# Altium schematic sheet k26_baseboard_usb_c_conn.SchDoc: k26 Baseboard USB-C Connector
size A3; DrawnBy: Ch. Vogt; Organization: PBL; DocumentNumber: 1; Revision: r5; SheetNumber: 11
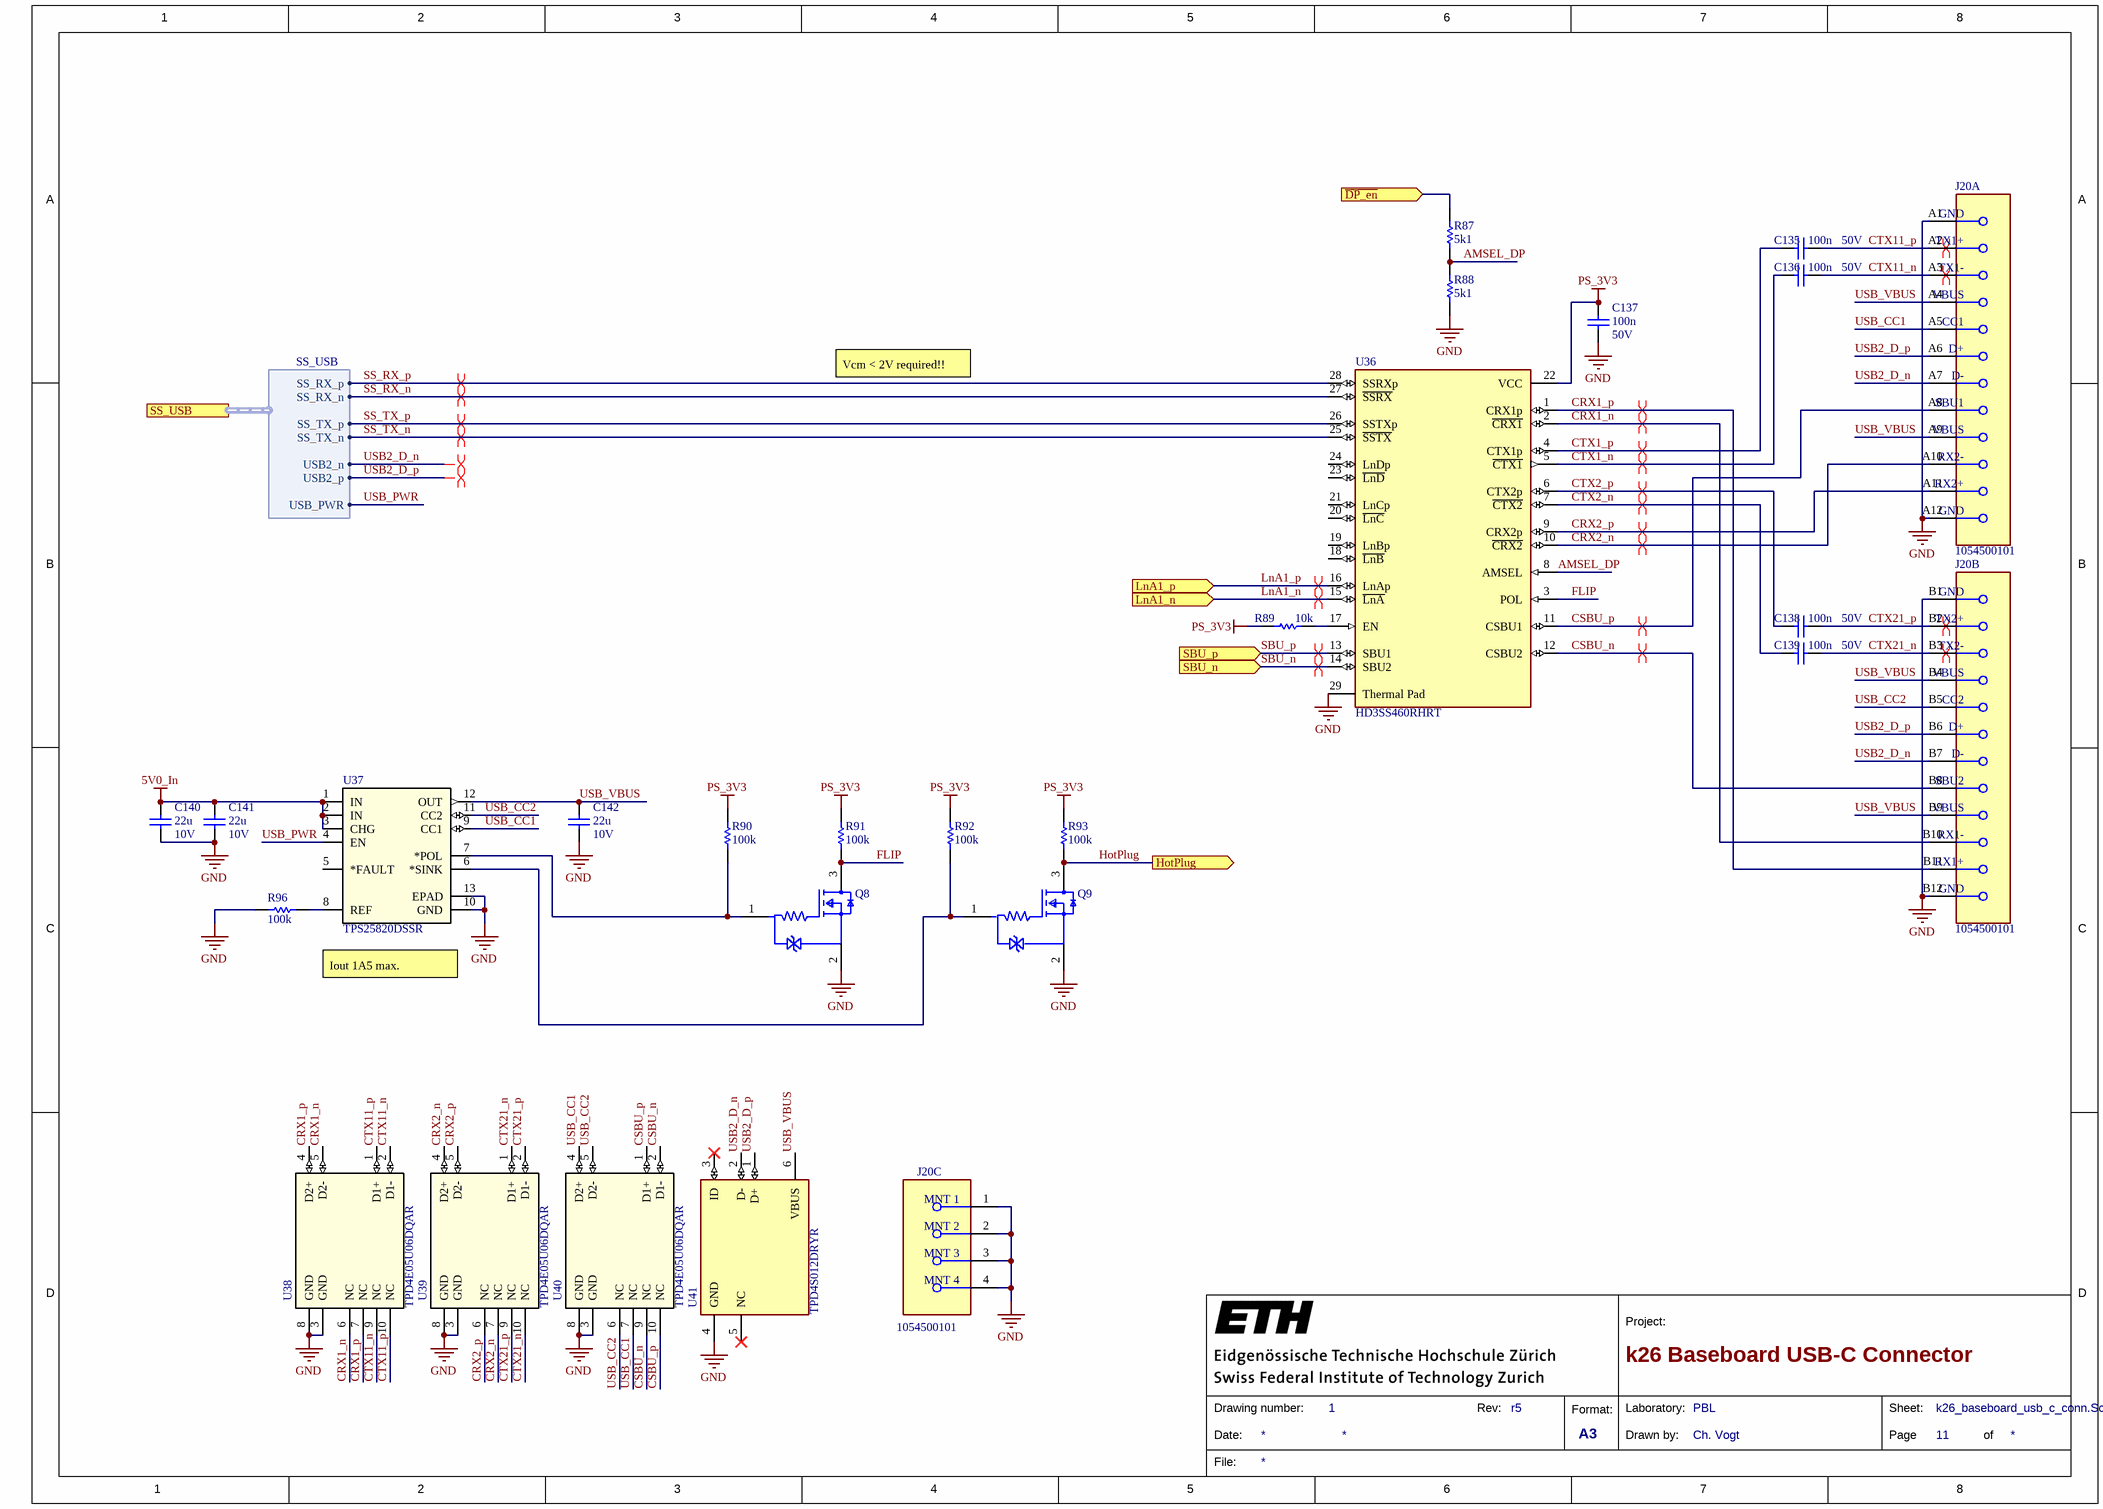
[diagram p0: k26_baseboard_usb_c_conn.SchDoc]

## Parts
C135  100n  Rated DC Voltage (URdc): 50V  [CAPC0402]
C136  100n  Rated DC Voltage (URdc): 50V  [CAPC0402]
C137  100n  Rated DC Voltage (URdc): 50V  [CAPC0402]
C138  100n  Rated DC Voltage (URdc): 50V  [CAPC0402]
C139  100n  Rated DC Voltage (URdc): 50V  [CAPC0402]
C140  22u  Rated DC Voltage (URdc): 10V  [CAPC1206]
C141  22u  Rated DC Voltage (URdc): 10V  [CAPC1206]
C142  22u  Rated DC Voltage (URdc): 10V  [CAPC1206]
J20  1054500101  [FP-1054500101-MFG]  (parts A,B,C of 3)
Q8  RUM001L02T2CL  [FP-VMT3-MFG]  (value not drawn)
Q9  RUM001L02T2CL  [FP-VMT3-MFG]  (value not drawn)
R87  5k1  [RES0402]
R88  5k1  [RES0402]
R89  10k  [RES0402]
R90  100k  [RES0402]
R91  100k  [RES0402]
R92  100k  [RES0402]
R93  100k  [RES0402]
R96  100k  [RES0402]
U36  HD3SS460RHRT  [FP-RHR0028A-IPC_C]
U37  TPS25820DSSR  [DSS12_P9X2_TEX]
U38  TPD4E05U06DQAR  [DQA0010A]
U39  TPD4E05U06DQAR  [DQA0010A]
U40  TPD4E05U06DQAR  [DQA0010A]
U41  TPD4S012DRYR  [FP-DRY0006A-MFG]

## Ports
HotPlug (out), LnA1_n (in), LnA1_p (in), SBU_n (in), SBU_p (in), SS_USB (harness SS_USB), ~{DP_en} (in)

## Harnesses
SS_USB: SS_RX_p, SS_RX_n, SS_TX_p, SS_TX_n, USB2_n, USB2_p, USB_PWR

## Nets
5V0_In: C140.2 C141.2 U37.1(IN) U37.2(IN) U37.3(CHG)
GND: C137.2 C140.1 C141.1 C142.1 J20.1(MNT_1) J20.2(MNT_2) J20.3(MNT_3) J20.4(MNT_4) J20.A1(GND) J20.A12(GND) J20.B1(GND) J20.B12(GND) Q8.2(Source) Q9.2(Source) R88.1 R96.1 U36.29(Thermal_Pad) U37.10(GND) U37.13(EPAD) U38.3(GND) U38.8(GND) U39.3(GND) U39.8(GND) U40.3(GND) U40.8(GND) U41.4(GND)
PS_3V3: C137.1 R89.2 R90.2 R91.2 R92.2 R93.2 U36.22(VCC)
AMSEL_DP: R87.1 R88.2 U36.8(AMSEL)
CRX1_n: J20.B10(RX1-) U36.2(~{CRX1}) U38.5(D2-) U38.6(NC)
CRX1_p: J20.B11(RX1+) U36.1(CRX1p) U38.4(D2+) U38.7(NC)
CRX2_n: J20.A10(RX2-) U36.10(~{CRX2}) U39.4(D2+) U39.7(NC)
CRX2_p: J20.A11(RX2+) U36.9(CRX2p) U39.5(D2-) U39.6(NC)
CSBU_n: J20.B8(SBU2) U36.12(CSBU2) U40.2(D1-) U40.9(NC)
CSBU_p: J20.A8(SBU1) U36.11(CSBU1) U40.1(D1+) U40.10(NC)
CTX1_n: C136.2 U36.5(~{CTX1})
CTX1_p: C135.2 U36.4(CTX1p)
CTX2_n: C139.2 U36.7(~{CTX2})
CTX2_p: C138.2 U36.6(CTX2p)
CTX11_n: C136.1 J20.A3(TX1-) U38.2(D1-) U38.9(NC)
CTX11_p: C135.1 J20.A2(TX1+) U38.1(D1+) U38.10(NC)
CTX21_n: C139.1 J20.B3(TX2-) U39.1(D1+) U39.10(NC)
CTX21_p: C138.1 J20.B2(TX2+) U39.2(D1-) U39.9(NC)
~{DP_en}: R87.2 ; port ~{DP_en}
FLIP: Q8.3(Drain) R91.1 U36.3(POL)
HotPlug: Q9.3(Drain) R93.1 ; port HotPlug
LnA1_n: U36.15(~{LnA}) ; port LnA1_n
LnA1_p: U36.16(LnAp) ; port LnA1_p
SBU_n: U36.14(SBU2) ; port SBU_n
SBU_p: U36.13(SBU1) ; port SBU_p
SS_RX_n: U36.27(~{SSRX}) ; port SS_USB.SS_RX_n
SS_RX_p: U36.28(SSRXp) ; port SS_USB.SS_RX_p
SS_TX_n: U36.25(~{SSTX}) ; port SS_USB.SS_TX_n
SS_TX_p: U36.26(SSTXp) ; port SS_USB.SS_TX_p
USB2_D_n: J20.A7(D-) J20.B7(D-) U41.2(D-) ; port SS_USB.USB2_n
USB2_D_p: J20.A6(D+) J20.B6(D+) U41.1(D+) ; port SS_USB.USB2_p
USB_CC1: J20.A5(CC1) U37.9(CC1) U40.4(D2+) U40.7(NC)
USB_CC2: J20.B5(CC2) U37.11(CC2) U40.5(D2-) U40.6(NC)
USB_PWR: U37.4(EN) ; port SS_USB.USB_PWR
USB_VBUS: C142.2 J20.A4(VBUS) J20.A9(VBUS) J20.B4(VBUS) J20.B9(VBUS) U37.12(OUT) U41.6(VBUS)
NetQ8_1: Q8.1(Gate) R90.1 U37.7(*POL)
NetQ9_1: Q9.1(Gate) R92.1 U37.6(*SINK)
NetR89_1: R89.1 U36.17(EN)
NetR96_2: R96.2 U37.8(REF)

Not connected (* = marked no-connect by the designer): U36 18(~{LnB}) 19(LnBp) 20(~{LnC}) 21(LnCp) 23(~{LnD}) 24(LnDp); U37 5(*FAULT); U41 3(ID)* 5(NC)*

## Layout directives
differential pair: CRX1_n, CRX1_p, CRX2_n, CRX2_p, CSBU_n, CSBU_p, CTX1_n, CTX1_p, CTX2_n, CTX2_p, CTX11_n, CTX11_p, CTX21_n, CTX21_p, LnA1_n, LnA1_p, SBU_n, SBU_p, SS_RX_n, SS_RX_p, SS_TX_n, SS_TX_p, USB2_D_n, USB2_D_p

## Notes on the sheet
- Vcm < 2V required!!
- Iout 1A5 max.
- 1
- 2
- 3
- 4
- 5
- 6
- 7
- 8
- A
- B
- C
- D
- Project:
- Date:
- Drawing number:
- Rev:
- Format:
- A3
- Drawn by:
- Laboratory:
- Page
- Sheet:
- of
- File:

## Library data of the parts
C135-C139 = cap0402: Ceramic Capacitor, Multilayer, Ceramic, 50V, 10% +Tol, 10% -Tol, X5R, 15% TC, 0.1uF, Surface Mount, 0402; Manufacturer: Yageo; Manufacturer Part Number: CC0402KRX5R9BB104; Capacitance: 100nF; Multilayer: Yes; Supplier 1: Farnell; Supplier Part Number 1: 3366442; RoHS: Yes; Category: Ceramic Capacitors; Stock 1: 180000; Pricing 1: 10000=0.00890, 50000=0.00870 (CHF); Mount: Surface Mount; Number of Pins: 2; Dielectric Material: Ceramic; Package Shape: Rectangular; Size Code: 0402; Terminal Finish: Nickel; Min Operating Temperature: -55°C; Max Operating Temperature: 85°C; JESD-609 Code: e3; Capacitor Type: Ceramic; Negative Tolerance: 10%; Temperature Characteristics Code: X5R; Termination: Wraparound; Positive Tolerance: 10%; Package Style: SMTMeter; Packaging: Tape and Reel; Length: 1mm; Width: 0.5mm; Height: 0.5mm; Reach SVHC Compliant: Yes; RoHS Compliant: Yes; ComponentLink1URL: https://datasheet.ciiva.com:443/pdfs/VipMasterIC/IC/YAGO/YAGO-S-A0006851646/YAGO-S-A0006851646-1.pdf?src-supplier=IHS+Markit; ComponentLink1Description: https://datasheet.ciiva.com:443/pdfs/VipMasterIC/IC/YAGO/YAGO-S-A0006851646/YAGO-S-A0006851646-1.pdf?src-supplier=IHS+Markit; ComponentLink2URL: http://www.yageo.com/documents/recent/UPY-GPHC_X5R_4V-to-50V_25.pdf?src-supplier=Digi-Key; ComponentLink2Description: http://www.yageo.com/documents/recent/UPY-GPHC_X5R_4V-to-50V_25.pdf?src-supplier=Digi-Key; ComponentLink3URL: http://www.yageo.com/documents/recent/UPY-GPHC_X5R_4V-to-50V_23.pdf?src-supplier=Digi-Key; ComponentLink3Description: http://www.yageo.com/documents/recent/UPY-GPHC_X5R_4V-to-50V_23.pdf?src-supplier=Digi-Key
C140-C142 = cap1206: Ceramic Capacitor, Multilayer, Ceramic, 10V, 10% +Tol, 10% -Tol, X7R, 15% TC, 22uF, Surface Mount, 1206; Manufacturer: Kyocera AVX; Manufacturer Part Number: 1206ZC226KAT2A; Multilayer: Yes; Supplier: Farnell; Supplier Part Number: 2094045; RoHS: Yes; Category: Ceramic Capacitors; Stock: 26392; Pricing: 5=0.49100, 50=0.42200, 250=0.37800, 500=0.33400, 1000=0.26300, 2500=0.23300, 12500=0.22800, 25000=0.22400 (CHF); Mounting Technology: Surface Mount; Pins: 2; Dielectric Material: Ceramic; Case/Package: 1206; Package Shape: Rectangular; Terminal Finish: Nickel; Min Operating Temperature: -55°C; Max Operating Temperature: 125°C; Value: 22uF; Capacitor Type: Ceramic; Tolerance  (fill in as +-): 10%; Packaging: Tape and Reel; Tolerance (fill in as +-): 10%; Termination: Wraparound; Temperature Characteristics Code: X7R; Package Style: SMTMeter; JESD-609 Code: e3; Length: 3.2mm; Width: 1.6mm; Height: 1.8mm; Reach SVHC Compliant: Yes; RoHS Compliant: Yes; ComponentLink1URL: https://datasheet.ciiva.com:443/pdfs/VipMasterIC/IC/AVXC/AVXC-S-A0009640452/AVXC-S-A0009640452-1.pdf?src-supplier=IHS+Markit; ComponentLink1Description: https://datasheet.ciiva.com:443/pdfs/VipMasterIC/IC/AVXC/AVXC-S-A0009640452/AVXC-S-A0009640452-1.pdf?src-supplier=IHS+Markit; ComponentLink2URL: https://datasheet.ciiva.com/25613/0900766b810a29b7-25613146.pdf?src-supplier=Rs; ComponentLink2Description: https://datasheet.ciiva.com/25613/0900766b810a29b7-25613146.pdf?src-supplier=Rs; ComponentLink3URL: https://datasheet.ciiva.com/7833/cx7r-7833598.pdf?src-supplier=Element14; ComponentLink3Description: https://datasheet.ciiva.com/7833/cx7r-7833598.pdf?src-supplier=Element14; ComponentLink4URL: https://datasheet.ciiva.com/5430/cx7r-218113-5430349.pdf?src-supplier=Mouser; ComponentLink4Description: https://datasheet.ciiva.com/5430/cx7r-218113-5430349.pdf?src-supplier=Mouser
J20 = CONN RCP USB3.1: CONN RCP USB3.1 TYPEC 24P SMD RA; Manufacturer: Molex; Manufacturer Part Number: 105450-0101; Number Of Contacts: 24; Voltage Rating: 30V; Shielding: true; Is Female: yes; Current Rating: 0.25/1.25/5A; Pitch: 0.5mm; Conn Orientation: Right Angle; Package: 0; Height: 3.44mm; Footprint Url: https://www.molex.com/pdm_docs/sd/1054500101_sd.pdf; Device Class L1: Connectors; Category: Conn; Device Class L2: USB Connectors; Digikey Description: CONN RCP USB3.1 TYPEC 24P SMD RA; Contact Material: Gold,Nickel; Mouser Description: USB Shielded I/O Receptacle; Type C; Right Angle; Surface Mount; Gold over Nickel; ComponentLink2Description: Datasheet; Lead Free: Yes; Automotive: No; Temperature Range High: +85°C; RoHS: TRUE; Octopart: https://octopart.com/105450-0101-molex-68082325; ComponentLink2URL: https://www.molex.com/webdocs/datasheets/pdf/en-us/1054500101_IO_CONNECTORS.pdf; Temperature: -30°C to +85°C; Usb Standard: USB 3.1; Temperature Range Low: -30°C; Device Class L3: unset; Manufacturer Part Number: 1054500101
Q8 Q9 = CMP-08982-000008-1: MOSFET N-CH 20V 0.1A VMT3; Manufacturer: Rohm; Threshold Vgs Min: 0.3V; Power Dissipation: 150mW; Standoff Height: 0mm; Max Forward Diode Voltage: 1.2V; Number Of N Channels: 1; Input Capacitace At Vds: 7.1pF @ 10V; Gate To Source Voltage: 8V; Pulse Drain Current: 400mA; Depletion Mode: False; Rthja Max: 833°C/W; Turn On Delay Time: 5ns; Turn Off Delay Time: 20ns; Max Junction Temp: +150°C; Threshold Vgs Max: 1V; Continuous Drain Current: 100mA; Drain To Source Resistance: 2.5Ω; Mouser Description: MOSFET; Temperature Range High: +150°C; Height: 0.55mm; Device Class L3: MOSFETs; Manufacturer Part Number: RUM001L02T2CL; Octopart: https://octopart.com/rum001l02t2cl-rohm-24403092; ComponentLink2Description: Datasheet; Drain To Source Voltage: 20V; Footprint Url: https://d1d2qsbl8m0m72.cloudfront.net/en/techdata_basic/transistor/dimension/VMT3_Dimension.pdf; Number Of Channels: 1; Device Class L1: Discrete Semiconductors; Category: Trans; Device Class L2: Transistors; Lead Free: Yes; Automotive: No; Package: VMT3; Temperature Range Low: -55°C; ComponentLink2URL: https://d1d2qsbl8m0m72.cloudfront.net/en/products/databook/datasheet/discrete/transistor/mosfet/rum001l02t2cl-e.pdf; Digikey Description: MOSFET N-CH 20V 0.1A VMT3; Drain To Source Breakdown Voltage: 20V; RoHS: TRUE; Temperature: -55°C to +150°C
R87 R88 = res0402: Fixed Resistor, Metal Glaze/thick Film, 0.0625W, 5100ohm, 50V, 1% +/-Tol, 100ppm/Cel, Surface Mount, 0402; Manufacturer: Yageo; Manufacturer Part Number: RC0402FR-075K1L; Power: 62.5mW; Value: 5.1kR; Temperature Coefficient: 100ppm/°C; Rated Temperature: 70°C; Additional Feature: LASER TRIMMABLE; Package Height: 0.35mm; Package Length: 1mm; Package Width: 0.5mm; Supplier: Rs; Supplier Part Number: 1987836; RoHS: Yes; Category: Chip SMD Resistors; Stock: 16400; Pricing: 100=0.01100, 1000=0.01100, 2500=0.00900, 5000=0.00800, 10000=0.00800 (CHF); Mounting Technology: Surface Mount; Pins: 2; Case/Package: 0402; Package Shape: Rectangular; Terminal Finish: Nickel; Min Operating Temperature: -55°C; Max Operating Temperature: 155°C; Tolerance: 1%; Resistor Type: FIXED RESISTOR; Construction: Chip; Package Style: SMTMeter; Technology: METAL GLAZE/THICK FILM; Termination: Wraparound; Working Voltage: 50V; JESD-609 Code: e3; Packaging: Tape and Reel; Reach SVHC Compliant: Yes; RoHS Compliant: Yes; ComponentLink1URL: https://datasheet.ciiva.com:443/pdfs/VipMasterIC/IC/YAGO/YAGO-S-A0008145938/YAGO-S-A0008145938-1.pdf?src-supplier=IHS+Markit; ComponentLink1Description: https://datasheet.ciiva.com:443/pdfs/VipMasterIC/IC/YAGO/YAGO-S-A0008145938/YAGO-S-A0008145938-1.pdf?src-supplier=IHS+Markit; ComponentLink2URL: https://datasheet.ciiva.com/7983/1018594-7983519.pdf?src-supplier=Element14; ComponentLink2Description: https://datasheet.ciiva.com/7983/1018594-7983519.pdf?src-supplier=Element14; ComponentLink3URL: https://datasheet.ciiva.com/46394/1018594-46394936.pdf?src-supplier=Element14; ComponentLink3Description: https://datasheet.ciiva.com/46394/1018594-46394936.pdf?src-supplier=Element14; ComponentLink4URL: https://datasheet.ciiva.com/2453/pyu-r-int-thick-7-2453401.pdf?src-supplier=Digi-Key; ComponentLink4Description: https://datasheet.ciiva.com/2453/pyu-r-int-thick-7-2453401.pdf?src-supplier=Digi-Key; ComponentLink5URL: https://datasheet.ciiva.com/2453/pyu-r-int-thick-7-2453402.pdf?src-supplier=Digi-Key; ComponentLink5Description: https://datasheet.ciiva.com/2453/pyu-r-int-thick-7-2453402.pdf?src-supplier=Digi-Key; ComponentLink6URL: https://datasheet.ciiva.com/2453/pyu-r-int-thick-7-2453400.pdf?src-supplier=Digi-Key; ComponentLink6Description: https://datasheet.ciiva.com/2453/pyu-r-int-thick-7-2453400.pdf?src-supplier=Digi-Key; ComponentLink7URL: https://datasheet.ciiva.com/12558/pyu-rc0402-51-rohs-l-6-r-8721-12558460.pdf?src-supplier=Mouser; ComponentLink7Description: https://datasheet.ciiva.com/12558/pyu-rc0402-51-rohs-l-6-r-8721-12558460.pdf?src-supplier=Mouser; ComponentLink8URL: https://datasheet.ciiva.com/16744/pyu-rc0402-51-rohs-l-6-r-16744283.pdf?src-supplier=Future+Electronics; ComponentLink8Description: https://datasheet.ciiva.com/16744/pyu-rc0402-51-rohs-l-6-r-16744283.pdf?src-supplier=Future+Electronics; ComponentLink9URL: https://datasheet.ciiva.com/15189/getdatasheetpartid-323636-15189493.pdf?src-supplier=Verical; ComponentLink9Description: https://datasheet.ciiva.com/15189/getdatasheetpartid-323636-15189493.pdf?src-supplier=Verical
R89 = res0402: Fixed Resistor, Metal Glaze/thick Film, 0.1W, 10000ohm, 50V, 1% +/-Tol, 100ppm/Cel, Surface Mount, 0402; Manufacturer: Panasonic; Manufacturer Part Number: ERJ-2RKF1002X; Power: 100mW; Value: 10kR; Temperature Coefficient: 100ppm/°C; Rated Temperature: 70°C; Package Height: 0.35mm; Package Length: 1mm; Package Width: 0.5mm; Reference Standard: AEC-Q200; ComponentLink1URL: https://datasheet.ciiva.com:443/pdfs/VipMasterIC/IC/PANA/PANA-S-A0009889626/PANA-S-A0009889626-1.pdf?src-supplier=IHS+Markit; ComponentLink1Description: https://datasheet.ciiva.com:443/pdfs/VipMasterIC/IC/PANA/PANA-S-A0009889626/PANA-S-A0009889626-1.pdf?src-supplier=IHS+Markit; ComponentLink2URL: https://datasheet.ciiva.com/6201/426256-6201373.pdf?src-supplier=Farnell; ComponentLink2Description: https://datasheet.ciiva.com/6201/426256-6201373.pdf?src-supplier=Farnell; ComponentLink3URL: https://datasheet.ciiva.com/46377/426256-46377550.pdf?src-supplier=Element14; ComponentLink3Description: https://datasheet.ciiva.com/46377/426256-46377550.pdf?src-supplier=Element14; ComponentLink4URL: https://datasheet.ciiva.com/22749/1678782-22749610.pdf?src-supplier=Element14; ComponentLink4Description: https://datasheet.ciiva.com/22749/1678782-22749610.pdf?src-supplier=Element14; ComponentLink5URL: https://datasheet.ciiva.com/28695/1678782-28695781.pdf?src-supplier=Element14; ComponentLink5Description: https://datasheet.ciiva.com/28695/1678782-28695781.pdf?src-supplier=Element14; ComponentLink6URL: https://datasheet.ciiva.com/16766/70260748-16766015.pdf?src-supplier=Allied+Electronics; ComponentLink6Description: https://datasheet.ciiva.com/16766/70260748-16766015.pdf?src-supplier=Allied+Electronics; ComponentLink7URL: https://datasheet.ciiva.com/16765/70260748-16765054.pdf?src-supplier=Allied+Electronics; ComponentLink7Description: https://datasheet.ciiva.com/16765/70260748-16765054.pdf?src-supplier=Allied+Electronics; ComponentLink8URL: https://datasheet.ciiva.com/9181/aoa0000ce2-9181461.pdf?src-supplier=Avnet; ComponentLink8Description: https://datasheet.ciiva.com/9181/aoa0000ce2-9181461.pdf?src-supplier=Avnet; ComponentLink9URL: https://datasheet.ciiva.com/16508/aoa0000ce2-16508382.pdf?src-supplier=Future+Electronics; ComponentLink9Description: https://datasheet.ciiva.com/16508/aoa0000ce2-16508382.pdf?src-supplier=Future+Electronics; Supplier: Rs; Supplier Part Number: 7325246; RoHS: Yes; Category: Chip SMD Resistors; Stock: 1630000; Pricing: 10000=0.00600, 30000=0.00500 (CHF); Mounting Technology: Surface Mount; Pins: 2; Case/Package: 0402; Terminal Finish: Nickel; Package Shape: Rectangular; Min Operating Temperature: -55°C; Max Operating Temperature: 155°C; Tolerance: 1%; Resistor Type: FIXED RESISTOR; Technology: METAL GLAZE/THICK FILM; Termination: Wraparound; Working Voltage: 50V; Construction: Rectangular; Package Style: SMTMeter; Packaging: Tape and Reel; JESD-609 Code: e3; Reach SVHC Compliant: Yes; RoHS Compliant: Yes
R90-R93 R96 = res0402: Fixed Resistor, Metal Glaze/thick Film, 0.1W, 100000ohm, 50V, 1% +/-Tol, 100ppm/Cel, Surface Mount, 0402; Manufacturer: Panasonic; Manufacturer Part Number: ERJ-2RKF1003X; Power: 100mW; Rated Temperature: 70°C; Value: 100kR; Temperature Coefficient: 100ppm/°C; Package Height: 0.35mm; Package Length: 1mm; Package Width: 0.5mm; Reference Standard: AEC-Q200; Supplier: Rs; Supplier Part Number: 7325255; RoHS: Yes; Category: Chip SMD Resistors; Stock: 780000; Pricing: 10000=0.00700, 20000=0.00600, 30000=0.00600, 50000=0.00600 (CHF); Mounting Technology: Surface Mount; Pins: 2; Case/Package: 0402; Terminal Finish: Nickel; Package Shape: Rectangular; Min Operating Temperature: -55°C; Max Operating Temperature: 155°C; Tolerance: 1%; JESD-609 Code: e3; Resistor Type: FIXED RESISTOR; Technology: METAL GLAZE/THICK FILM; Termination: Wraparound; Working Voltage: 50V; Construction: Rectangular; Package Style: SMTMeter; Packaging: Tape and Reel; Reach SVHC Compliant: Yes; RoHS Compliant: Yes; ComponentLink1URL: https://datasheet.ciiva.com:443/pdfs/VipMasterIC/IC/PANA/PANA-S-A0009889626/PANA-S-A0009889626-1.pdf?src-supplier=IHS+Markit; ComponentLink1Description: https://datasheet.ciiva.com:443/pdfs/VipMasterIC/IC/PANA/PANA-S-A0009889626/PANA-S-A0009889626-1.pdf?src-supplier=IHS+Markit; ComponentLink2URL: https://datasheet.ciiva.com/34303/1987038-34303550.pdf?src-supplier=Jameco; ComponentLink2Description: https://datasheet.ciiva.com/34303/1987038-34303550.pdf?src-supplier=Jameco; ComponentLink3URL: https://datasheet.ciiva.com/7830/aoa0000ce2-7830725.pdf?src-supplier=Element14; ComponentLink3Description: https://datasheet.ciiva.com/7830/aoa0000ce2-7830725.pdf?src-supplier=Element14; ComponentLink4URL: https://datasheet.ciiva.com/7830/426256-7830974.pdf?src-supplier=Element14; ComponentLink4Description: https://datasheet.ciiva.com/7830/426256-7830974.pdf?src-supplier=Element14; ComponentLink5URL: https://datasheet.ciiva.com/43467/1678782-43467480.pdf?src-supplier=Farnell; ComponentLink5Description: https://datasheet.ciiva.com/43467/1678782-43467480.pdf?src-supplier=Farnell; ComponentLink6URL: https://datasheet.ciiva.com/22723/426256-22723902.pdf?src-supplier=Element14; ComponentLink6Description: https://datasheet.ciiva.com/22723/426256-22723902.pdf?src-supplier=Element14; ComponentLink7URL: https://datasheet.ciiva.com/16778/70260748-16778055.pdf?src-supplier=Allied+Electronics; ComponentLink7Description: https://datasheet.ciiva.com/16778/70260748-16778055.pdf?src-supplier=Allied+Electronics; ComponentLink8URL: https://datasheet.ciiva.com/16784/70260748-16784190.pdf?src-supplier=Allied+Electronics; ComponentLink8Description: https://datasheet.ciiva.com/16784/70260748-16784190.pdf?src-supplier=Allied+Electronics
U36 = CMP-04877-000008-1: IC MUX/DEMUX 4CH TYPE C2 28WQFN; Max Supply Voltage: 3.6V; Number of Ports: 4; Data Rate: 5.4Gbps; USB Standard: USB 3.1; Bandwidth: 5.4GHz; Min Supply Voltage: 3V; REACH SVHC: No SVHC; Max Operating Temperature: 85°C; Mount: Surface Mount; Lead Free: Lead Free; Packaging: Cut Tape; RoHS Compliant: Yes; Number of Pins: 28; Min Operating Temperature: -40°C
U37 = TPS25820DSSR: No Description Available; Mfr_Name: Texas Instruments; Copyright: Copyright (C) 2023 Ultra Librarian. All rights reserved.; Manufacturer_Part_Number: TPS25820DSSR; RefDes: RefDes; Type: DEV
U38-U40 = TPD4E05U06DQAR: No Description Available; Mfr_Name: Texas Instruments; CompType: IC; Type: DEV; RefDes: RefDes; Copyright: Copyright (C) 2022 Ultra Librarian. All rights reserved.; Manufacturer_Part_Number: TPD4E05U06DQAR; Digi-Key_Part_Number_1: 296-35765-1-ND; Digi-Key_Part_Number_2: 296-35765-2-ND; Digi-Key_Part_Number_3: 296-35765-6-ND; Application_BuildNumber: *; PartNumber: TPD4E05U06DQAR; PackageReference: DQA0010A; MountType: SMT; RoHS: Y; Manufacturer: Texas Instruments
U41 = CMP-0326-00038-4: TVS DIODE 5.5V 6SON; Manufacturer: Texas Instruments; Breakdown Voltage: 24V; Interface: USB; ESD Protection: Yes; Peak Pulse Power: 60W; Number of Circuits: 4; Polarity: Unidirectional; Capacitance: 15pF; Test Current: 1mA; Working Voltage: 19V; Min Breakdown Voltage: 6V; Peak Pulse Current: 3A; Operating Supply Voltage: 950mV; Max Operating Temperature: 85°C; Packaging: Tape and Reel; Termination: SMD/SMT; Number of Pins: 6; Radiation Hardening: No; Width: 1.05mm; REACH SVHC: No SVHC; Lead Free: Lead Free; Depth: 1mm; Package Quantity: 5000; Length: 1.45mm; Direction: Unidirectional; Min Operating Temperature: -40°C; Number of Channels: 4; Max Power Dissipation: 60W; Height: 0.55mm; Manufacturer Part Number: TPD4S012DRYR